# EAGLE design controller_board3 (EAGLE 9.4.0)
Assembly variants: Minimal, FullAwesome
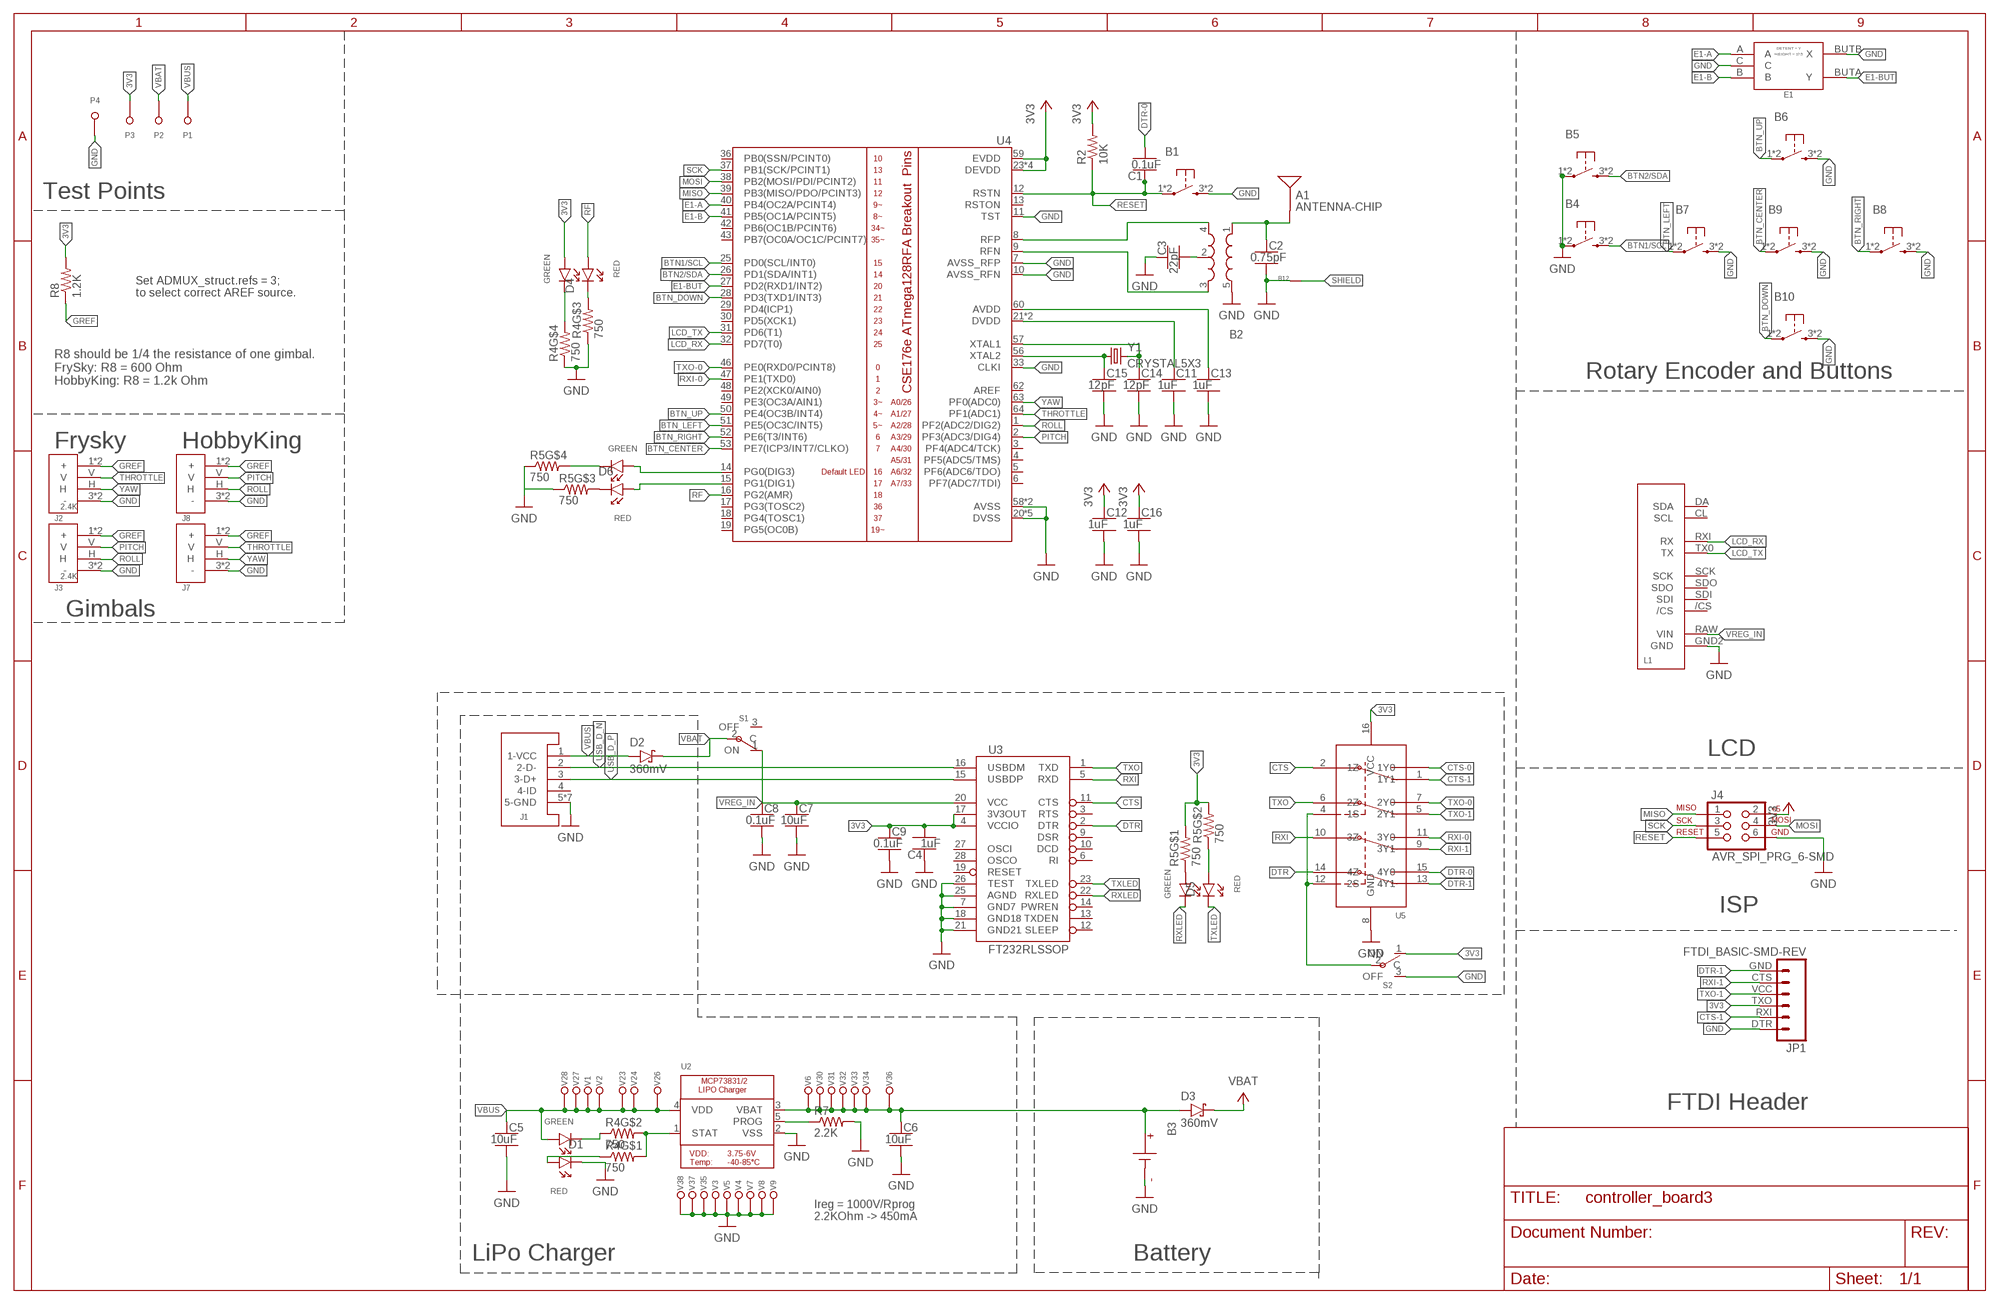
[diagram p0: schematic, sheet 1]
FRAME1 (FRAME_B_L): CREATOR: Unknown; DIST: Unknown; DISTPN: Unknown

## Parts
A1  ANTENNA-CHIP  [ANTENNA-CHIP]
B1  PUSHBUTTON_-4.5X4.5  [4.5MM_TACTILE_SWITCH_TL3305AF160QG]
B2  BALUN0805  [BALUN]
B3  BATTERY  [BATTERY-TERMINALS]
B4  PUSHBUTTON_-4.5X4.5  [4.5MM_TACTILE_SWITCH_TL3305AF160QG]  (not fitted in variant Minimal)
B5  PUSHBUTTON_-4.5X4.5  [4.5MM_TACTILE_SWITCH_TL3305AF160QG]  (not fitted in variant Minimal)
B6  PUSHBUTTON_-4.5X4.5  [4.5MM_TACTILE_SWITCH_TL3305AF160QG]
B7  PUSHBUTTON_-4.5X4.5  [4.5MM_TACTILE_SWITCH_TL3305AF160QG]
B8  PUSHBUTTON_-4.5X4.5  [4.5MM_TACTILE_SWITCH_TL3305AF160QG]
B9  PUSHBUTTON_-4.5X4.5  [4.5MM_TACTILE_SWITCH_TL3305AF160QG]
B10  PUSHBUTTON_-4.5X4.5  [4.5MM_TACTILE_SWITCH_TL3305AF160QG]
B12  NET_BRIDGE  [NET_BRIDGE]
C1  0.1uF  CAPACITOR-NP_SMD-2012-0805_CERAMIC-0.1UF  [CAPC2012X140_HS]
C2  0.75pF  CAPACITOR-NP_SMD-2012-0805_CERAMIC-0.75PF  [CAPC2012X140_HS]
C3  22pF  CAPACITOR-NP_SMD-2012-0805_CERAMIC-22PF  [CAPC2012X140_HS]
C4  1uF  CAPACITOR-NP_SMD-2012-0805_CERAMIC-1UF  [CAPC2012X140_HS]
C5  10uF  CAPACITOR-NP_SMD-0603_CERAMIC-10UF  [CAPC1608X100]
C6  10uF  CAPACITOR-NP_SMD-0603_CERAMIC-10UF  [CAPC1608X100]
C7  10uF  CAPACITOR-NP_SMD-0603_CERAMIC-10UF  [CAPC1608X100]  (not fitted in variant Minimal)
C8  0.1uF  CAPACITOR-NP_SMD-2012-0805_CERAMIC-0.1UF  [CAPC2012X140_HS]  (not fitted in variant Minimal)
C9  0.1uF  CAPACITOR-NP_SMD-2012-0805_CERAMIC-0.1UF  [CAPC2012X140_HS]  (not fitted in variant Minimal)
C11  1uF  CAPACITOR-NP_SMD-2012-0805_CERAMIC-1UF  [CAPC2012X140_HS]
C12  1uF  CAPACITOR-NP_SMD-2012-0805_CERAMIC-1UF  [CAPC2012X140_HS]
C13  1uF  CAPACITOR-NP_SMD-2012-0805_CERAMIC-1UF  [CAPC2012X140_HS]
C14  12pF  CAPACITOR-NP_SMD-2012-0805_CERAMIC-12PF  [CAPC2012X140_HS]
C15  12pF  CAPACITOR-NP_SMD-2012-0805_CERAMIC-12PF  [CAPC2012X140_HS]
C16  1uF  CAPACITOR-NP_SMD-2012-0805_CERAMIC-1UF  [CAPC2012X140_HS]
D1  LED-2X-GREEN/RED-1.6X1.5MM  [LED-2X-LITE-ON-1.6MMX1.5MM]
D2  360mV  DIODE-SCHOTTKY_SMD-SOD123-360MV  [SOD3716X135_HS]
D3  360mV  DIODE-SCHOTTKY_SMD-SOD123-360MV  [SOD3716X135_HS]
D4  LED-2X-GREEN/RED-1.6X1.5MM  [LED-2X-LITE-ON-1.6MMX1.5MM]
D5  LED-2X-GREEN/RED-1.6X1.5MM  [LED-2X-LITE-ON-1.6MMX1.5MM]  (not fitted in variant Minimal)
D6  LED-2X-GREEN/RED-1.6X1.5MM  [LED-2X-LITE-ON-1.6MMX1.5MM]
E1  ROTARY-ENCODER-W/BUTTON-BOURNS-PEC12R-4217F  [BOURNS-PEC12R]
J1  USB-MICROA-AMPHENOL-10118192-0001LF  [USB-MICROA-10118192-0001LF]  (not fitted in variant Minimal)
J2  2.4K  FRSKY-GIMBAL-FRYSKY  [JST-13-PTH]  (not fitted in variant Minimal)
J3  2.4K  FRSKY-GIMBAL-FRYSKY  [JST-13-PTH]  (not fitted in variant Minimal)
J4  AVR_SPI_PRG_6-SMD  [2X3-SMD]
J7  FRSKY-GIMBAL-2X-SERVO-SMD  [2X-SERVO-SMD]
J8  FRSKY-GIMBAL-2X-SERVO-SMD  [2X-SERVO-SMD]
JP1  FTDI_BASIC-SMD-REV  [FTDI-BASIC-SMD]
L1  SPARKFUN_SERLCD_SERIAL_REDUCED-SMD  [SPARKFUN_SERLCD_16X2_REDUCED_SMD]
P1  TEST-POINT  [TEST-POINT-KEYSTONE-5000]  (not fitted in variant Minimal)
P2  TEST-POINT  [TEST-POINT-KEYSTONE-5000]  (not fitted in variant Minimal)
P3  TEST-POINT  [TEST-POINT-KEYSTONE-5000]  (not fitted in variant Minimal)
P4  TEST-POINT  [TEST-POINT-KEYSTONE-5000]  (not fitted in variant Minimal)
R2  10K  RESISTOR_SMD-2012-0805-10K  [RESC2012X60_HS]
R4  750  RESISTOR-PACK-4X-750  [RESCAXS50P200X100X45-8]
R5  750  RESISTOR-PACK-4X-750  [RESCAXS50P200X100X45-8]
R7  2.2K  RESISTOR_SMD-2012-0805-2.2K  [RESC2012X60_HS]
R8  1.2K  RESISTOR_SMD-2012-0805-1.2K  [RESC2012X60_HS]  (not fitted in variant Minimal)
S1  POWER-SWITCH-MFS201N-9-Z-SMD-VERTICAL  [JS102011JCQN]  (not fitted in variant Minimal)
S2  POWER-SWITCH-MFS201N-9-Z-SMD-VERTICAL  [JS102011JCQN]  (not fitted in variant Minimal)
U2  MCP73831T-2ACI/OT  MCP73831/2  [SOT23-5]
U3  FT232RLSSOP  [SSOP28DB]  (not fitted in variant Minimal)
U4  ATMEGA128RFA1  [QFN-64]
U5  DPDT-X2  [SOP65P640X110-16]  (not fitted in variant Minimal)
V1  LOCKED-VIA-0.2  [VIA-0.2MM]
V2  LOCKED-VIA-0.2  [VIA-0.2MM]
V3  LOCKED-VIA-0.2  [VIA-0.2MM]
V4  LOCKED-VIA-0.2  [VIA-0.2MM]
V5  LOCKED-VIA-0.2  [VIA-0.2MM]
V6  LOCKED-VIA-0.2  [VIA-0.2MM]
V7  LOCKED-VIA-0.2  [VIA-0.2MM]
V8  LOCKED-VIA-0.2  [VIA-0.2MM]
V9  LOCKED-VIA-0.2  [VIA-0.2MM]
V23  LOCKED-VIA-0.2  [VIA-0.2MM]
V24  LOCKED-VIA-0.2  [VIA-0.2MM]
V26  LOCKED-VIA-0.2  [VIA-0.2MM]
V27  LOCKED-VIA-0.2  [VIA-0.2MM]
V28  LOCKED-VIA-0.2  [VIA-0.2MM]
V30  LOCKED-VIA-0.2  [VIA-0.2MM]
V31  LOCKED-VIA-0.2  [VIA-0.2MM]
V32  LOCKED-VIA-0.2  [VIA-0.2MM]
V33  LOCKED-VIA-0.2  [VIA-0.2MM]
V34  LOCKED-VIA-0.2  [VIA-0.2MM]
V35  LOCKED-VIA-0.2  [VIA-0.2MM]
V36  LOCKED-VIA-0.2  [VIA-0.2MM]
V37  LOCKED-VIA-0.2  [VIA-0.2MM]
V38  LOCKED-VIA-0.2  [VIA-0.2MM]
Y1  CRYSTAL5X3  [CRYSTAL-SMD-5X3]

## Nets
3V3 [HIGH-I]: C4.2 C9.1 C12.1 C16.1 D4.A2 J4.2 JP1.TXO P3.T R2.2 R5.5 R5.6 R8.2 S2.1(ON) U3.4(VCCIO) U3.17(3V3OUT) U4.23(DEVDD) U4.34(DEVDD) U4.44(DEVDD) U4.54(DEVDD) U4.59(EVDD) U5.16(VCC)
ANTENNA [RFSIG]: A1.FEED(SIGNAL) B2.1(IN) C2.1
BCAP: B2.2(GND) C3.2
BPOS [LONG_PWR]: B3.+(P) C6.1 D3.A U2.3(VBAT) V6.P1(N) V30.P1(N) V31.P1(N) V32.P1(N) V33.P1(N) V34.P1(N) V36.P1(N)
BTN1/SCL: B4.3 B4.4 U4.25(PD0(SCL/INT0))
BTN2/SDA: B5.3 B5.4 U4.26(PD1(SDA/INT1))
BTN_CENTER: B9.1 B9.2 U4.53(PE7(ICP3/INT7/CLKO))
BTN_DOWN: B10.1 B10.2 U4.28(PD3(TXD1/INT3))
BTN_LEFT: B7.1 B7.2 U4.51(PE5(OC3C/INT5))
BTN_RIGHT: B8.1 B8.2 U4.52(PE6(T3/INT6))
BTN_UP: B6.1 B6.2 U4.50(PE4(OC3B/INT4))
CLK_NEG: C15.1 U4.56(XTAL2) Y1.1
CLK_POS: C14.1 U4.57(XTAL1) Y1.3
CTS: U3.11(CTS) U5.2(1Z)
CTS-0: U5.3(1Y0)
CTS-1: JP1.RXI U5.1(1Y1)
DTR: U3.2(DTR) U5.14(4Z)
DTR-0: C1.2 U5.15(4Y0)
DTR-1: JP1.GND U5.13(4Y1)
E1-A: E1.A U4.40(PB4(OC2A/PCINT4))
E1-B: E1.B U4.41(PB5(OC1A/PCINT5))
E1-BUT: E1.BUTA(Y) U4.27(PD2(RXD1/INT2))
GND [HIGH-I]: B1.3 B1.4 B2.5(GND) B3.-(N) B4.1 B4.2 B5.1 B5.2 B6.3 B6.4 B7.3 B7.4 B8.3 B8.4 B9.3 B9.4 B10.3 B10.4 B12.P1 C2.2 C3.1 C4.1 C5.2 C6.2 C7.2 C8.2 C9.2 C11.2 C12.2 C13.2 C14.2 C15.2 C16.2 D1.C1 E1.BUTB(X) E1.C J1.5(5-GND) J1.6(5-GND) J1.7(5-GND) J1.8(5-GND) J1.9(5-GND) J1.10(5-GND) J1.11(5-GND) J2.3(-) J2.6(-) J3.3(-) J3.6(-) J4.6 J7.3(-) J7.6(-) J8.3(-) J8.6(-) JP1.DTR L1.GND2(GND) P4.T R4.1 R4.2 R5.1 R5.2 R7.2 S2.3(OFF) U2.2(VSS) U3.7(GND7) U3.18(GND18) U3.21(GND21) U3.25(AGND) U3.26(TEST) U4.7(AVSS_RFP) U4.10(AVSS_RFN) U4.11(TST) U4.20(DVSS) U4.24(DVSS) U4.33(CLKI) U4.35(DVSS) U4.45(DVSS) U4.55(DVSS) U4.58(AVSS) U4.61(AVSS) U5.8(GND) V3.P1(N) V4.P1(N) V5.P1(N) V7.P1(N) V8.P1(N) V9.P1(N) V35.P1(N) V37.P1(N) V38.P1(N)
GREF: J2.1(+) J2.4(+) J3.1(+) J3.4(+) J7.1(+) J7.4(+) J8.1(+) J8.4(+) R8.1
LCD_RX: L1.RXI(RX) U4.32(PD7(T0))
LCD_TX: L1.TX0(TX) U4.31(PD6(T1))
MISO: J4.1 U4.39(PB3(MISO/PDO/PCINT3))
MOSI: J4.4 U4.38(PB2(MOSI/PDI/PCINT2))
N$1: D1.A1 R4.4
N$2: D1.C2 R4.3
N$3: D5.A1 R5.3
N$4: D6.C2 R5.8
N$5: D6.C1 R5.7
N$6: D4.C1 R4.7
N$7: D5.A2 R5.4
N$8: D6.A2 U4.14(PG0(DIG3))
N$9: D6.A1 U4.15(PG1(DIG1))
N$11: R4.5 R4.6 U2.1(STAT)
N$12: R7.1 U2.5(PROG)
N$13: D4.C2 R4.8
N$20: C11.1 U4.21(DVDD) U4.22(DVDD)
N$21: C13.1 U4.60(AVDD)
PITCH: J3.V J8.V U4.2(PF3(ADC3/DIG4))
PROG_SEL: S2.2(C) U5.4(1S) U5.12(2S)
RESET: B1.1 B1.2 C1.1 J4.5 R2.1 U4.12(RSTN)
RF: D4.A1 U4.16(PG2(AMR))
RF_N: B2.3(OUT2) U4.9(RFN)
RF_P: B2.4(OUT1) U4.8(RFP)
ROLL: J3.H J8.H U4.1(PF2(ADC2/DIG2))
RXI: U3.5(RXD) U5.10(3Z)
RXI-0: U4.47(PE1(TXD0)) U5.11(3Y0)
RXI-1: JP1.CTS U5.9(3Y1)
RXLED: D5.C2 U3.22(RXLED)
SCK: J4.3 U4.37(PB1(SCK/PCINT1))
SHIELD: B12.P2
THROTTLE: J2.V J7.V U4.64(PF1(ADC1))
TXLED: D5.C1 U3.23(TXLED)
TXO: U3.1(TXD) U5.6(2Z)
TXO-0: U4.46(PE0(RXD0/PCINT8)) U5.7(2Y0)
TXO-1: JP1.VCC U5.5(2Y1)
USB_D_N: J1.2(2-D-) U3.16(USBDM)
USB_D_P: J1.3(3-D+) U3.15(USBDP)
VBAT [PWR]: D2.C D3.C P2.T S1.2(C)
VBUS [PWR]: C5.1 D1.A2 D2.A J1.1(1-VCC) P1.T U2.4(VDD) V1.P1(N) V2.P1(N) V23.P1(N) V24.P1(N) V26.P1(N) V27.P1(N) V28.P1(N)
VREG_IN [PWR]: C7.1 C8.1 L1.RAW(VIN) S1.1(ON) U3.20(VCC)
YAW: J2.H J7.H U4.63(PF0(ADC0))
Unconnected: J1.4(4-ID) L1./CS L1.CL(SCL) L1.DA(SDA) L1.SCK L1.SDI L1.SDO S1.3(OFF) U3.3(RTS) U3.6(RI) U3.9(DSR) U3.10(DCD) U3.12(SLEEP) U3.13(TXDEN) U3.14(PWREN) U3.19(RESET) U3.27(OSCI) U3.28(OSCO) U4.3(PF4(ADC4/TCK)) U4.4(PF5(ADC5/TMS)) U4.5(PF6(ADC6/TDO)) U4.6(PF7(ADC7/TDI)) U4.13(RSTON) U4.17(PG3(TOSC2)) U4.18(PG4(TOSC1)) U4.19(PG5(OC0B)) U4.29(PD4(ICP1)) U4.30(PD5(XCK1)) U4.36(PB0(SSN/PCINT0)) U4.42(PB6(OC1B/PCINT6)) U4.43(PB7(OC0A/OC1C/PCINT7)) U4.48(PE2(XCK0/AIN0)) U4.49(PE3(OC3A/AIN1)) U4.62(AREF)

## Notes on the sheet
- Test Points
- Set ADMUX_struct.refs = 3;
  to select correct AREF source.
- Rotary Encoder and Buttons
- R8 should be 1/4 the resistance of one gimbal.
  FrySky: R8 = 600 Ohm
  HobbyKing: R8 = 1.2k Ohm
- Frysky | HobbyKing
- Gimbals
- LCD
- ISP
- FTDI Header
- Ireg = 1000V/Rprog
  2.2KOhm -> 450mA
- LiPo Charger | Battery

## Library data of the parts
A1 = quadparts_prebuilt:ANTENNA: Single endded antenna.; CREATOR: Swanson; DATASHEET: http://www.linxtechnologies.com/resources/data-guides/ant-xxx-chp-x.pdf; DIST: Digikey; DISTPN: ANT-2.45-CHPCT-ND; MFR: Linx Technologies Inc.; MOUNTING: SMD; MPN: ANT-2.45-CHP-T; PRICE: 3.16; REVIEWER: Swanson
B1 B4-B10 = quadparts_prebuilt:PUSHBUTTON_: "Tactile" or "clicky" button.; CREATOR: Swanson; DIST: DIGIKEY; DISTPN: EG5350CT-ND; MOUNTING: SMD
B2 = quadparts_prebuilt:BALUN: A balun to convert differential radio-frequency outputs from the microcontroller into a single-ended driver for the antenna.; CREATOR: Swanson; DATASHEET: http://katalog.we-online.de/pbs/datasheet/748421245.pdf; DIST: Digikey; DISTPN: 732-2230-1-ND; MFR: Wurth Electronics Inc; MOUNTING: SMD; MPN: 748421245; PRICE: 2.63; REVIEWER: Swanson
B3 = quadparts_prebuilt:BATTERY: Connections for a battery.; CREATOR: Swanson; DIST: NA; DISTPN: NA; MOUNTING: NONE
B12 = custom:NET_BRIDGE; CREATOR: Michael Gonzalez; DIST: NA; DISTPN: NA
C1 C8 C9 = quadparts_prebuilt:CAPACITOR-NP_: Nonpolarized capacitor; CREATOR: Swanson; DIST: Digikey; DISTPN: 445-1418-1-ND; MFR: TDK; MOUNTING: SMD; MPN: C2012X7R2A104K125AA; REVIEWER: Swanson
C2 = quadparts_prebuilt:CAPACITOR-NP_: Nonpolarized capacitor; CREATOR: Swanson; DIST: Digikey; DISTPN: 490-3585-1-ND; MFR: Murata Electronics North America; MOUNTING: SMD; MPN: GQM2195C2AR75CB01D; REVIEWER: Swanson
C3 = quadparts_prebuilt:CAPACITOR-NP_: Nonpolarized capacitor; CREATOR: Swanson; DIST: Digikey; DISTPN: 490-5534-1-ND; MFR: Murata Electronics North America; MOUNTING: SMD; MPN: GRM21A5C2E220JW01D; REVIEWER: Swanson
C4 C11-C13 C16 = quadparts_prebuilt:CAPACITOR-NP_: Nonpolarized capacitor; CREATOR: Swanson; DIST: Digikey; DISTPN: 587-1281-1-ND; MFR: Taiyo Yuden; MOUNTING: SMD; MPN: TMK212B7105KG-T; REVIEWER: Swanson
C5-C7 = quadparts_prebuilt:CAPACITOR-NP_: Nonpolarized capacitor; CREATOR: Swanson; DIST: Digikey; DISTPN: 1276-1119-1-ND; MOUNTING: SMD
C14 C15 = quadparts_prebuilt:CAPACITOR-NP_: Nonpolarized capacitor; CREATOR: Swanson; DIST: Digikey; DISTPN: 490-5531-1-ND; MFR: Murata Electronics North America; MOUNTING: SMD; MPN: GRM21A5C2E120JW01D; REVIEWER: Swanson
D1 D4-D6 = RemoteParts:LED-2X; COLOR1: GREEN; COLOR2: RED; CREATOR: Swanson; DIST: DIGIKEY; DISTPN: 160-2252-1-ND; MOUNTING: SMD
D2 D3 = quadparts_prebuilt:DIODE-SCHOTTKY_: Schottky diode; CREATOR: Swanson; DIST: Digikey; DISTPN: CRS08QMCT-ND; MFR: Toshiba Semiconductor and Storage; MOUNTING: SMD; MPN: CRS08(TE85L,Q,M); REVIEWER: Swanson
E1 = RemoteParts:ROTARY-ENCODER-W/BUTTON; AUX1DIST: DIGIKEY; AUX1DISTPN: 1722-1241-ND; CREATOR: Swanson; DETENT: Y; DIST: DIGIKEY; DISTPN: PEC12R-4217F-S0024-ND; HEIGHT: 17.5; MOUNTING: TH
J1 = RemoteParts:USB; CREATOR: Swanson; DIST: DIGIKEY; DISTPN: 609-4613-1-ND; MOUNTING: SMD
J2 = RemoteParts:FRSKY-GIMBAL; CREATOR: Swanson; DIST: Digikey; DISTPN: A100106-ND; MOUNTING: TH
J3 = RemoteParts:FRSKY-GIMBAL; CREATOR: Swanson; DIST: Digikey; DISTPN: A100106-ND; MOUNTING: TH; SPICEPREFIX: E
J4 = quadparts_prebuilt:AVR_SPI_PRG_6: AVR ISP 6 Pin This is the in-system programming (ISP) connector for Atmel Microcontrollers programming.; CREATOR: Swanson; DIST: Digikey; DISTPN: 952-1922-ND; MOUNTING: SMD
J7 J8 = RemoteParts:FRSKY-GIMBAL
JP1 = quadparts_prebuilt:FTDI_BASIC: FTDI (USB-serial converter) header bins with labels.; DIST: DIGIKEY; DISTPN: 952-3235-ND; LEFT_PIN: G; MOUNTING: SMD; RIGHT_PIN: B
L1 = RemoteParts:SPARKFUN_SERLCD_SERIAL_REDUCED; AUX1DIST: DIGIKEY; AUX1DISTPN: 952-1842-ND; AUX2DIST: Digikey; AUX2DISTPN: S5641-ND; CREATOR: Swanson; DIST: Sparkfun; DISTPN: LCD-14072
P1-P4 = RemoteParts:TEST-POINT; CREATOR: Swanson; DIST: DIGIKEY; DISTPN: 36-5001-ND; MOUNTING: TH
R2 = quadparts_prebuilt:RESISTOR_: Resistor; CREATOR: Swanson; DIST: Digikey; DISTPN: 311-10KARCT-ND; MFR: Yageo; MOUNTING: SMD; MPN: RC0805JR-0710KL; REVIEWER: Swanson
R4 R5 = quadparts_prebuilt:RESISTOR-PACK-4X; CREATOR: Swanson; DIST: DIGIKEY; DISTPN: Y10751CT-ND; MOUNTING: SMD
R7 = quadparts_prebuilt:RESISTOR_: Resistor; CREATOR: SWANSON; DIST: DIGIKEY; DISTPN: YAG3776CT-ND; MOUNTING: SMD
R8 = quadparts_prebuilt:RESISTOR_: Resistor; CREATOR: Swanson; DIST: DIGIKEY; DISTPN: 311-1.20KCRCT-ND; MOUNTING: SMD
S1 S2 = RemoteParts:POWER-SWITCH-MFS201N-9-Z; CREATOR: Swanson; DIST: DIGIKEY; DISTPN: CKN10721CT-ND; MOUNTING: SMD
U2 = RemoteParts:MCP73831/2: MCP73831/2 LIPO Charger VDD: 3.75 - 6V Temp -40 - 85°C Programmable Charge Rate: 15-500mA NOTE: STAT is a tri-state logic output on the MCP73831 and an open-drain output on the MCP73832. SOT23-5 with 4.2V output and tri-state logic on STAT = MCP73831T-2ACI/OT; CREATOR: Adafruit; DIST: DIGIKEY; DISTPN: MCP73831T-2ACI/OTCT-ND; MOUNTING: SMD
U3 = RemoteParts:FT232RL: USB UART FT232RL 4th Generation USB UART (USB <-> Serial) Controller. Spark Fun Electronics SKU : COM-00650; CREATOR: Swanson; DIST: DIGIKEY; DISTPN: 768-1007-1-ND; MOUNTING: SMD
U4 = quadparts_prebuilt:ATMEGA128RFA1: ATmega128RFA1 8-bit AVR Microcontroller with Low Power 2.4GHz Transceiver for ZigBee and IEEE 802.15.4; CREATOR: Swanson; DATASHEET: http://www.atmel.com/Images/Atmel-8266-MCU_Wireless-ATmega128RFA1_Datasheet.pdf; DIST: Digikey; DISTPN: ATMEGA128RFA1-ZU-ND; MFR: Atmel; MOUNTING: SMD; MPN: ATMEGA128RFA1-ZUR00; PRICE: 10.21; REVIEWER: Swanson
U5 = RemoteParts:DPDT-X2; CREATOR: Swanson; DIST: DIGIKEY; DISTPN: 568-5300-1-ND; MOUNTING: SMD
V1-V9 V23 V24 V26-V28 V30-V38 = quadparts_prebuilt:LOCKED-VIA: A via that be removed via ripup.; CREATOR: Swanson; DIST: NA; DISTPN: NA; MOUNTING: NONE
Y1 = quadparts_prebuilt:CRYSTAL: Crystals to provide clock references for microcontrollers, etc.; CREATOR: Swanson; DATASHEET: http://www.abracon.com/Resonators/abm3b.pdf; DIST: Digikey; DISTPN: 535-9122-1-ND; MFR: Abracon LLC; MOUNTING: SMD; MPN: ABM3B-16.000MHZ-B2-T; PRICE: 0.68; PROD_ID: XTAL-08218; REVIEWER: Swanson

## Net classes
1 HIGH-I: drill 0.254 mm
2 RFSIG: width 1.016 mm
3 PWR: width 0.254 mm, drill 0.381 mm
4 LONG_PWR: width 0.254 mm, drill 0.381 mm

## Board
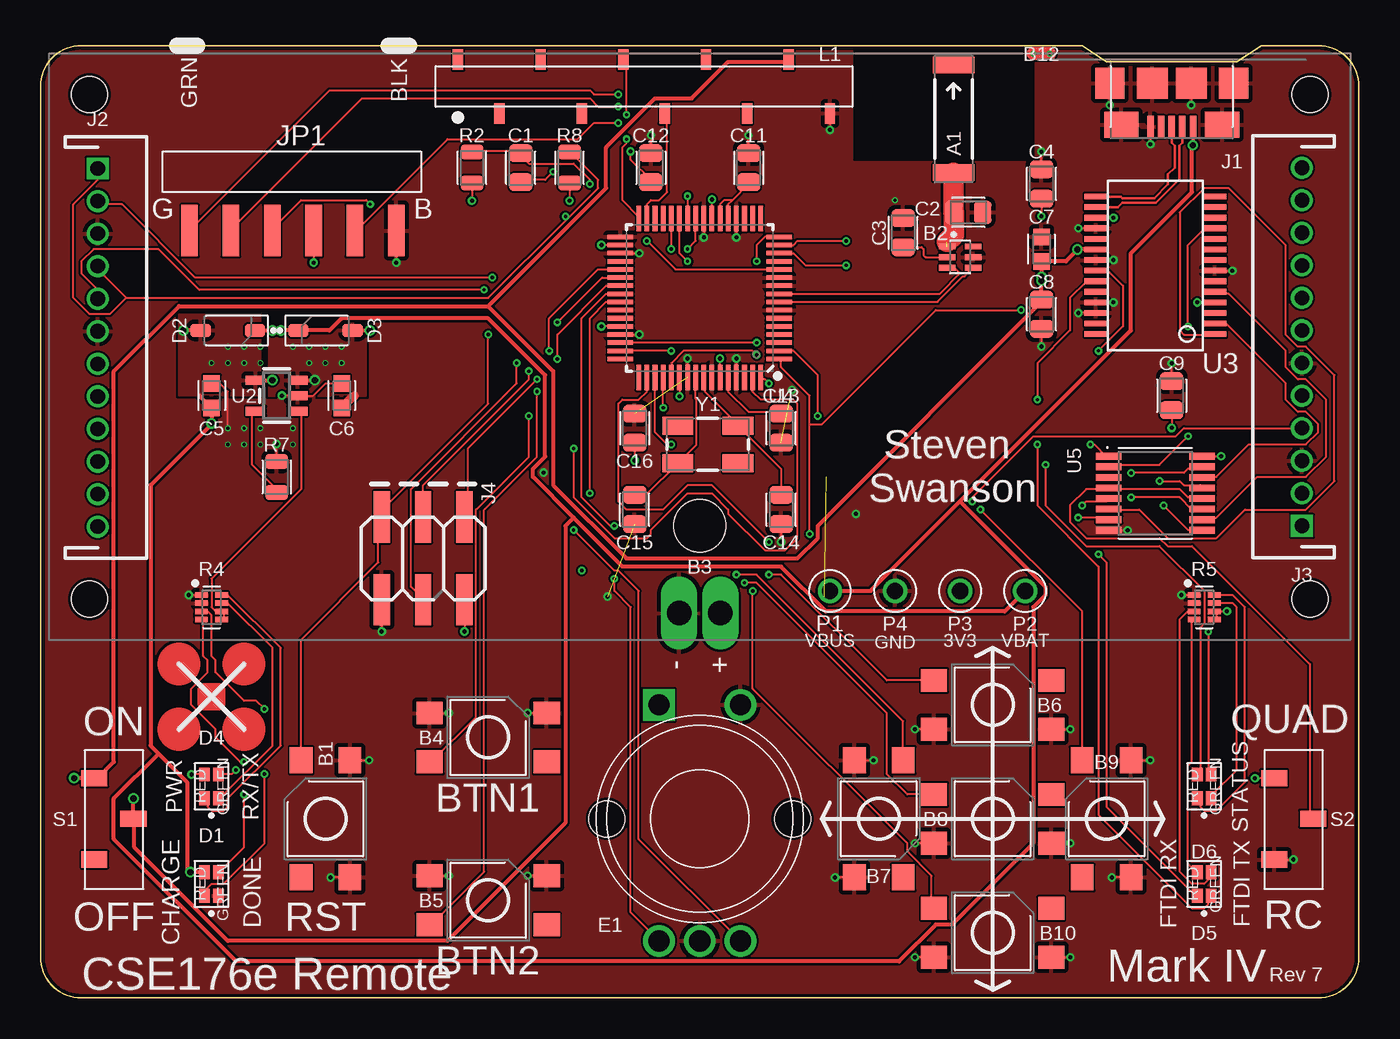
[diagram p1: board, top side]
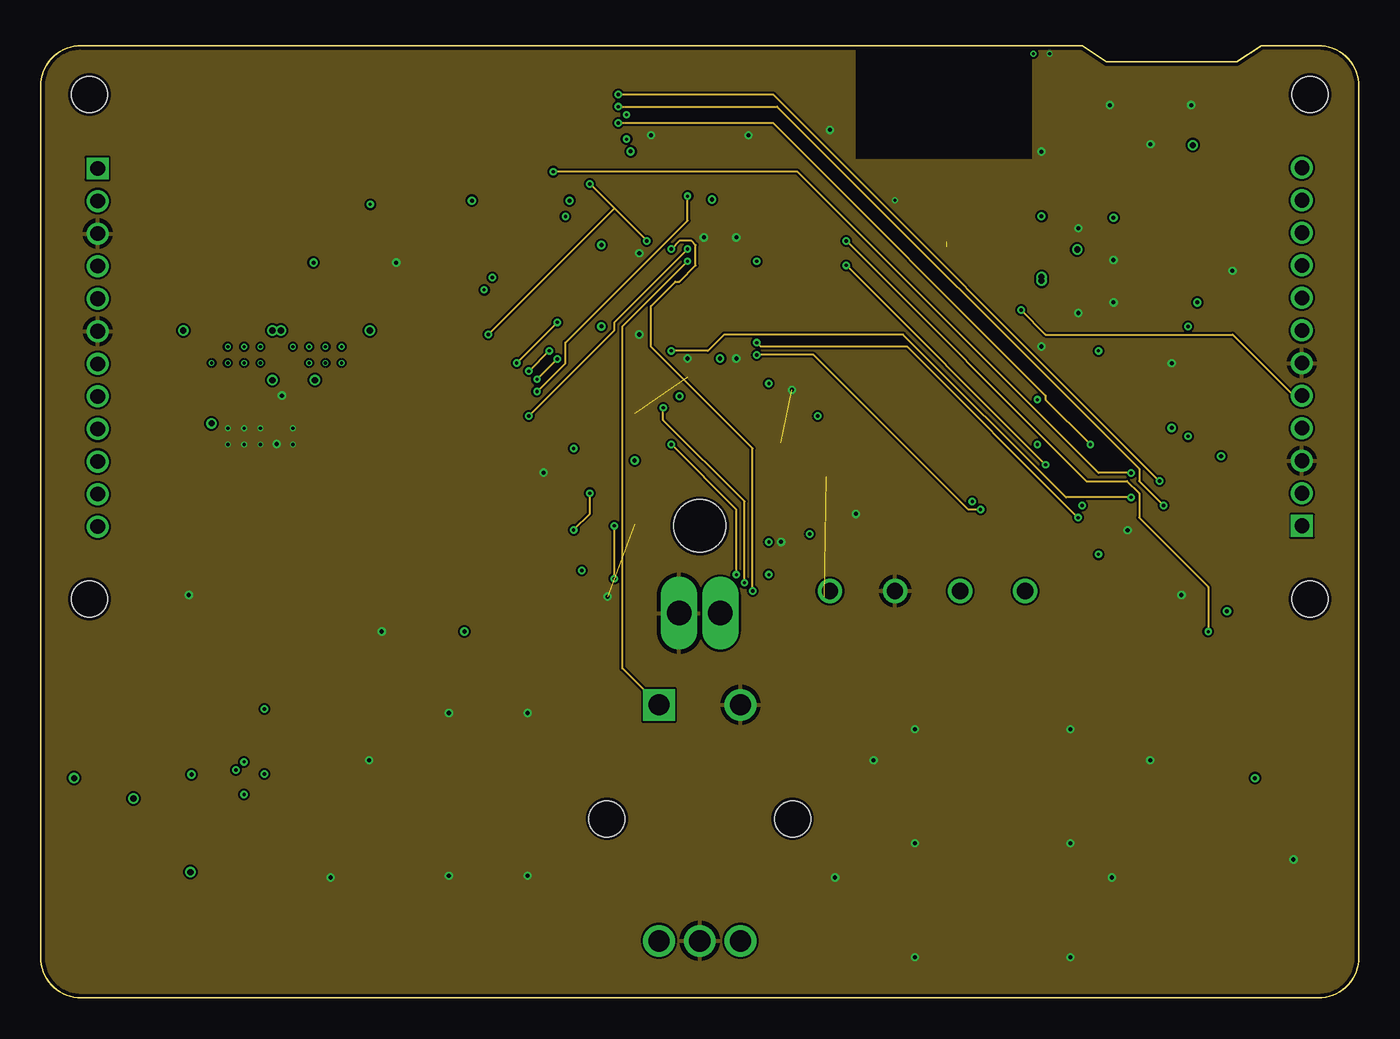
[diagram p2: board, inner layer Route2]
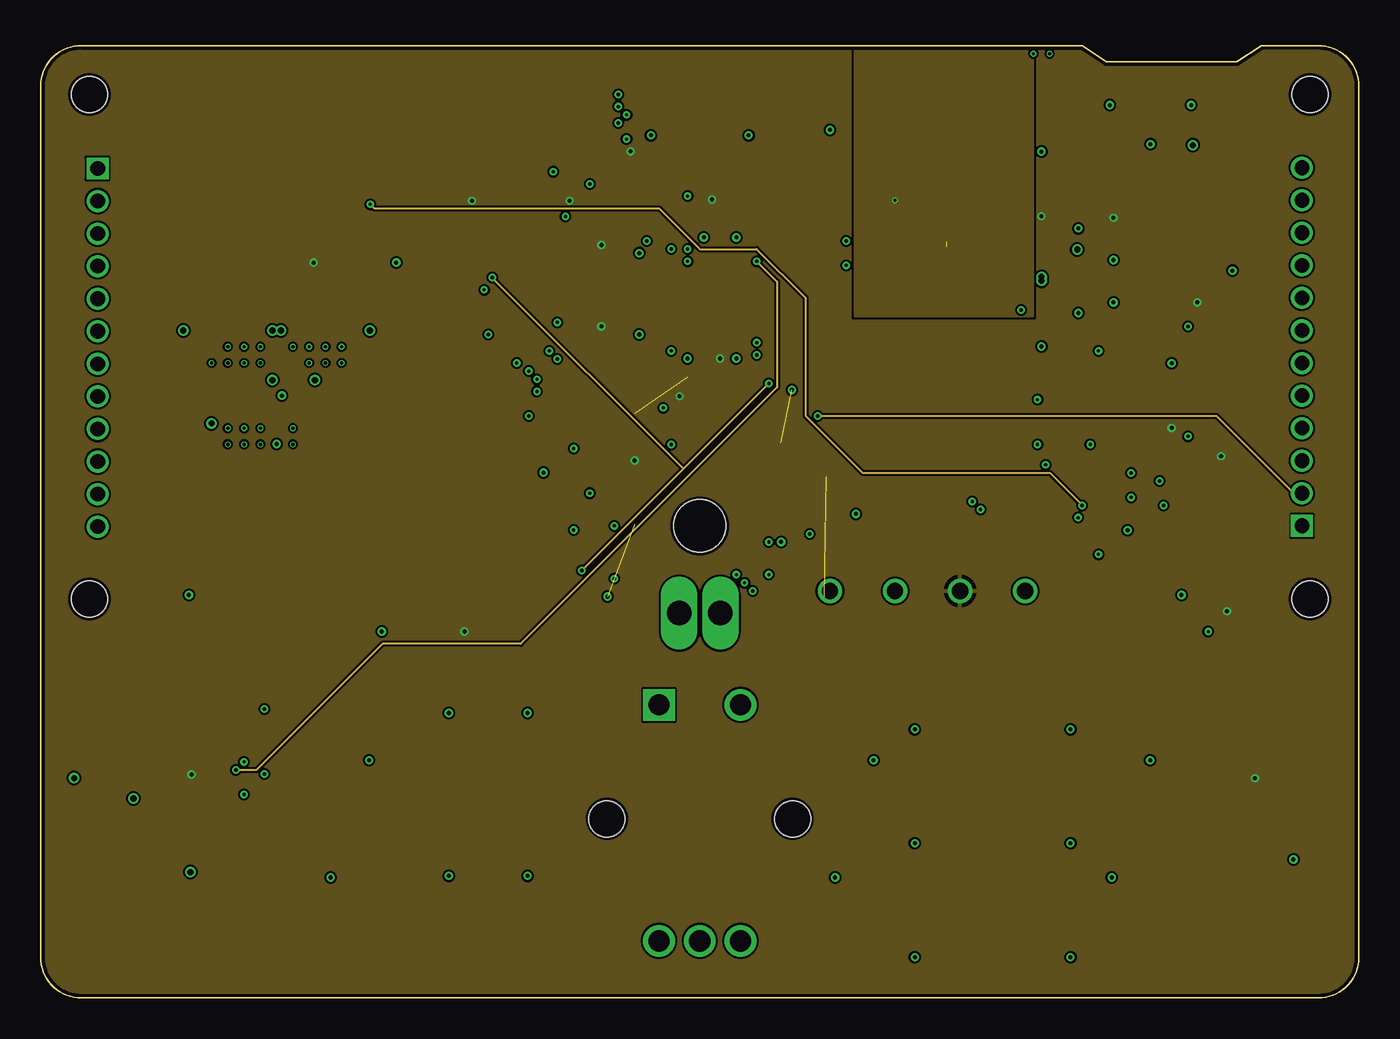
[diagram p3: board, inner layer Route15]
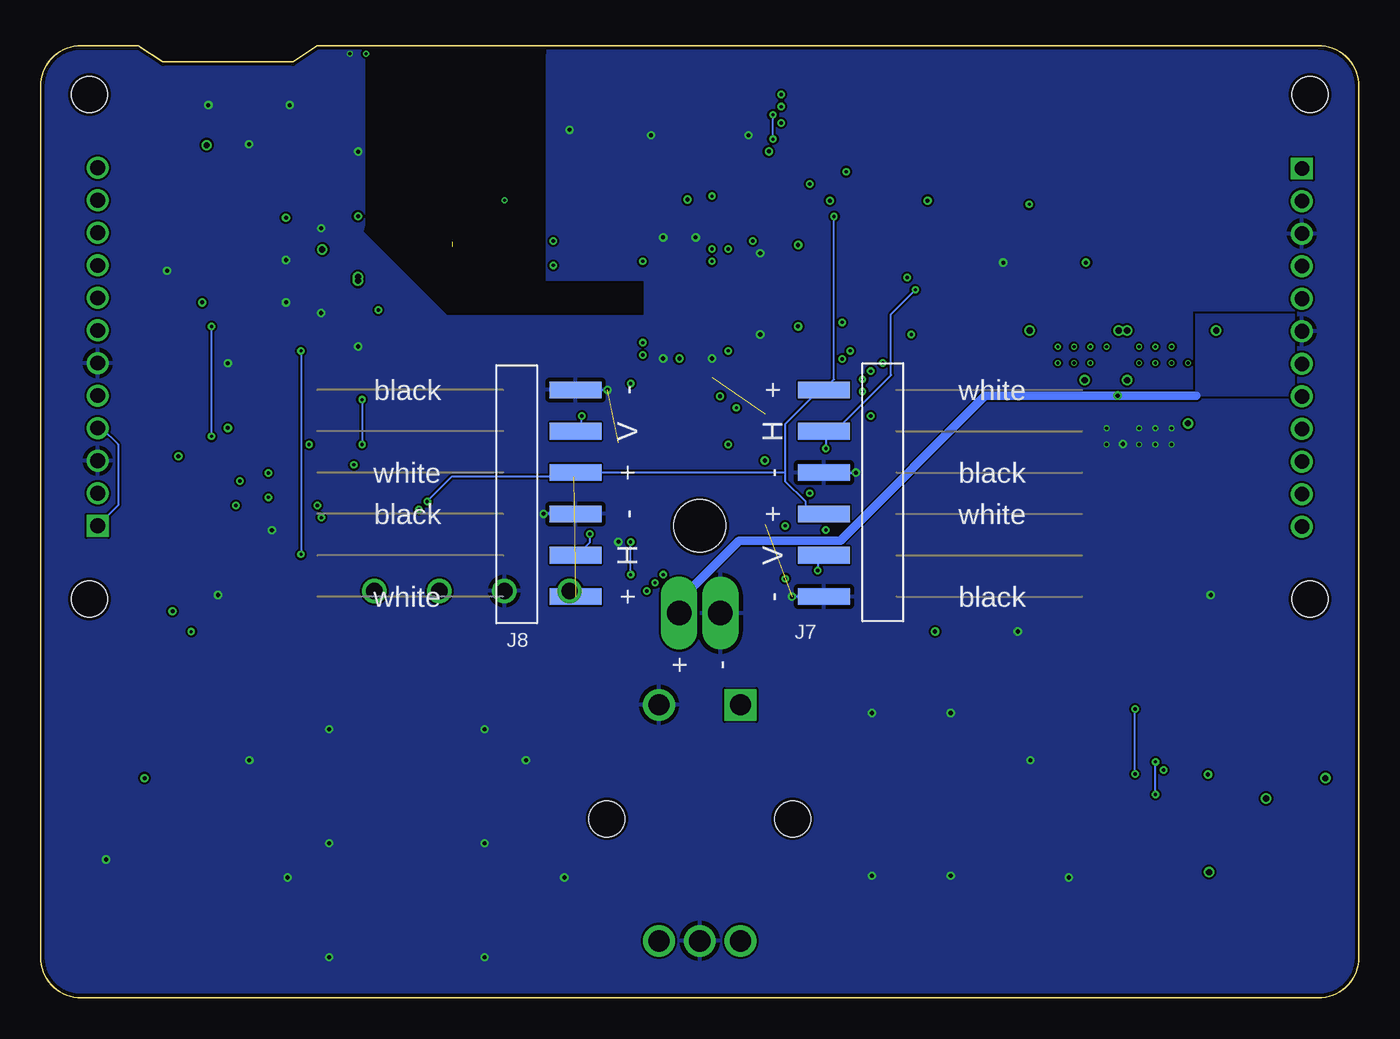
[diagram p4: board, bottom side, seen from below]

Size 81 x 58.5 mm. Coordinates in mm from the lower left corner, seen from the top.
Outline: 2.5,0 78.5,0 arc90 81,2.5 81,56 arc90 78.5,58.5 75,58.5 73.5,57.5 65.5,57.5 64,58.5 2.5,58.5 arc90 0,56 0,2.5 arc90 2.5,0
Copper layers (1*2*15*16): Top 0.035559375mm / dielectric 1.501140625mm / Route2 0.035559375mm / dielectric 0.149859375mm / Route15 0.035559375mm / dielectric 0.200659375mm / Bottom 0.035559375mm
Design rules "jlcpcb-4layer-5mil-small-cream": minimum track width 5mil, minimum drill 0.2mm, track to track 5mil, track to pad 5mil, pad to pad 5mil, via to via 5mil, smd to smd 5mil, copper to edge 0.2mm, drill to drill 10mil, minimum pad ring 3mil, minimum via ring 5mil, stop-mask expansion 3mil, vias tented up to drill 0.45mm, thermal gap 10mil
Holes 3.2 mm at 40.5,29
tRestrict: 4 lines
bRestrict: area 44,42 to 61.1,59; 4 lines

### Footprints (pad centres in the part's own frame; a part is rotated, then mirrored left to right if it is on the bottom)
ANTENNA-CHIP = smd 1.016 x 2.54: FEED -3.302,0; NC 3.302,0
4.5MM_TACTILE_SWITCH_TL3305AF160QG = smd 1.6 x 1.4: 1 -3.6,-1.5; 2 3.6,-1.5; 3 -3.6,1.5; 4 3.6,1.5
BALUN = smd 0.35 x 1: 1 -0.65,-0.8; 2 0,-0.8; 3 0.65,-0.8; 4 0.65,0.8; 5 0,0.8; 6 -0.65,0.8
BATTERY-TERMINALS = drill 1.5 long: + -1.27,-0.635; - 1.27,-0.635
NET_BRIDGE = drill 0.2: P1 -0.5,0; P2 0.5,0
CAPC2012X140_HS = smd 1.08 x 1.42: 1 -0.895,0; 2 0.895,0
CAPC1608X100 = smd 1.009 x 1.015: 1 -0.753,0; 2 0.753,0
LED-2X-LITE-ON-1.6MMX1.5MM = smd 0.85 x 0.65: A1 -0.725,0.425; A2 -0.725,-0.425; C1 0.725,0.425; C2 0.725,-0.425
SOD3716X135_HS = smd 1.25 x 0.8: A 1.665,0; C -1.665,0
BOURNS-PEC12R = drill 1.3: A -2.5,-7.5; B 2.5,-7.5; BUTB 2.5,7; C 0,-7.5 | drill 1.3 square: BUTA -2.5,7 | hole 2.2: -5.7,0; 5.7,0
FRSKY-TARANIS-GIMBAL = hole 2.2: -27,-27; -27,27; -27,27; 27,-27; 27,27
USB-MICROA-10118192-0001LF = smd 0.4 x 1.35: 1 -1.3,0; 2 -0.65,0; 3 0,0; 4 0.65,0; 5 1.3,0 | smd 2.1 x 1.6: 6 3.1,-0.125; 7 -3.1,-0.125 | smd 1.8 x 1.9: 8 -3.8,-2.675; 11 3.8,-2.675 | smd 1.9 x 1.9: 9 1.2,-2.675; 10 -1.2,-2.675
JST-13-PTH = drill 0.9 square: 1 -2,0 | drill 0.9: 3 2,0; 4 4,0; 6 8,0; 7 10,0; 8 12,0; 9 14,0; 10 16,0; 11 18,0; 12 20,0; H 6,0; V 0,0
2X3-SMD = smd 1 x 3.15: 1 -2.54,-2.54; 2 -2.54,2.54; 3 0,-2.54; 4 0,2.54; 5 2.54,-2.54; 6 2.54,2.54
2X-SERVO-SMD = smd 1.02 x 3.17: 1 -6.35,0.635; 3 -1.27,0.635; 4 1.27,0.635; 6 6.35,0.635; H -3.81,0.635; V 3.81,0.635
FTDI-BASIC-SMD = smd 1.02 x 3.17: CTS -3.81,0.635; DTR 6.35,0.635; GND -6.35,0.635; RXI 3.81,0.635; TXO 1.27,0.635; VCC -1.27,0.635
SPARKFUN_SERLCD_16X2_REDUCED_SMD = smd 0.635 x 1.27: /CS -7.24,14.336; CL 0.38,17.636; DA 2.92,14.336; GND2 8,14.336; RAW 5.46,17.636; RXI -4.7,17.636; SCK -14.86,17.636; SDI -9.78,17.636; SDO -12.32,14.336; TX0 -2.16,14.336 | hole 2.2: -37.5,-15.5; -37.5,15.5; 37.5,-15.5; 37.5,15.5
TEST-POINT-KEYSTONE-5000 = drill 1: T 0,0
RESC2012X60_HS = smd 0.92 x 1.38: 1 -0.955,0; 2 0.955,0
RESCAXS50P200X100X45-8 = smd 0.79 x 0.339: 1 -0.62,0.75; 2 -0.62,0.25; 3 -0.62,-0.25; 4 -0.62,-0.75; 5 0.62,-0.75; 6 0.62,-0.25; 7 0.62,0.25; 8 0.62,0.75
JS102011JCQN = smd 1 x 1.6: 1 -2.5,-1.2; 2 0,1.2; 3 2.5,-1.2
SOT23-5 = smd 0.55 x 1.2: 1 -0.95,-1.3; 2 0,-1.3; 3 0.95,-1.3; 4 0.95,1.3; 5 -0.95,1.3
SSOP28DB = smd 0.348 x 1.397: 1 -4.225,-3.656; 2 -3.575,-3.656; 3 -2.925,-3.656; 4 -2.275,-3.656; 5 -1.625,-3.656; 6 -0.975,-3.656; 7 -0.325,-3.656; 8 0.325,-3.656; 9 0.975,-3.656; 10 1.625,-3.656; 11 2.275,-3.656; 12 2.925,-3.656; 13 3.575,-3.656; 14 4.225,-3.656; 15 4.225,3.656; 16 3.575,3.656; 17 2.925,3.656; 18 2.275,3.656; 19 1.625,3.656; 20 0.975,3.656; 21 0.325,3.656; 22 -0.325,3.656; 23 -0.975,3.656; 24 -1.625,3.656; 25 -2.275,3.656; 26 -2.925,3.656; 27 -3.575,3.656; 28 -4.225,3.656
QFN-64 = smd 1.562 x 0.28: 1 -4.881,3.75; 2 -4.881,3.25; 3 -4.881,2.75; 4 -4.881,2.25; 5 -4.881,1.75; 6 -4.881,1.25; 7 -4.881,0.75; 8 -4.881,0.25; 9 -4.881,-0.25; 10 -4.881,-0.75; 11 -4.881,-1.25; 12 -4.881,-1.75; 13 -4.881,-2.25; 14 -4.881,-2.75; 15 -4.881,-3.25; 16 -4.881,-3.75; 33 4.881,-3.75; 34 4.881,-3.25; 35 4.881,-2.75; 36 4.881,-2.25; 37 4.881,-1.75; 38 4.881,-1.25; 39 4.881,-0.75; 40 4.881,-0.25; 41 4.881,0.25; 42 4.881,0.75; 43 4.881,1.25; 44 4.881,1.75; 45 4.881,2.25; 46 4.881,2.75; 47 4.881,3.25; 48 4.881,3.75 | smd 0.28 x 1.562: 17 -3.75,-4.881; 18 -3.25,-4.881; 19 -2.75,-4.881; 20 -2.25,-4.881; 21 -1.75,-4.881; 22 -1.25,-4.881; 23 -0.75,-4.881; 24 -0.25,-4.881; 25 0.25,-4.881; 26 0.75,-4.881; 27 1.25,-4.881; 28 1.75,-4.881; 29 2.25,-4.881; 30 2.75,-4.881; 31 3.25,-4.881; 32 3.75,-4.881; 49 3.75,4.881; 50 3.25,4.881; 51 2.75,4.881; 52 2.25,4.881; 53 1.75,4.881; 54 1.25,4.881; 55 0.75,4.881; 56 0.25,4.881; 57 -0.25,4.881; 58 -0.75,4.881; 59 -1.25,4.881; 60 -1.75,4.881; 61 -2.25,4.881; 62 -2.75,4.881; 63 -3.25,4.881; 64 -3.75,4.881
SOP65P640X110-16 = smd 1.572 x 0.407: 1 -2.872,2.275; 2 -2.872,1.625; 3 -2.872,0.975; 4 -2.872,0.325; 5 -2.872,-0.325; 6 -2.872,-0.975; 7 -2.872,-1.625; 8 -2.872,-2.275; 9 2.872,-2.275; 10 2.872,-1.625; 11 2.872,-0.975; 12 2.872,-0.325; 13 2.872,0.325; 14 2.872,0.975; 15 2.872,1.625; 16 2.872,2.275
VIA-0.2MM = drill 0.2 pad 0.3: P1 0,0
CRYSTAL-SMD-5X3 = smd 1.9 x 1.1: 1 -1.85,-1.15; 2 1.85,-1.15; 3 1.85,1.15; 4 -1.85,1.15

### Placement (x,y rotation side)
A1  56.1,54 90 top
B1  17.5,11 270 top
B2  56.5,45.5 270 top
B3  40.5,23 180 top
B4  27.5,16 180 top
B5  27.5,6 180 top
B6  58.5,18 180 top
B7  51.5,11 90 top
B8  58.5,11 180 top
B9  65.5,11 270 top
B10  58.5,4 180 top
B12  61.5,58 180 top
C1  29.5,51 270 top
C2  57,48.25 0 top
C3  53,47 270 top
C4  61.5,50 270 top
C5  10.5,37 90 top
C6  18.5,37 90 top
C7  61.5,46 90 top
C8  61.5,42 270 top
C9  69.5,37 90 top
C11  43.5,51 90 top
C12  37.5,51 90 top
C13  45.5,35 270 top
C14  45.5,30 270 top
C15  36.5,30 270 top
C16  36.5,35 90 top
D1  10.5,7 270 top
D2  11.5,41 180 top
D3  17.5,41 0 top
D4  10.5,13 270 top
D5  71.5,7 270 top
D6  71.5,13 270 top
E1  40.5,11 0 top
E$1  [FRSKY-TARANIS-GIMBAL]  -39.5,30 0 top  (outside the outline)
E$2  [FRSKY-TARANIS-GIMBAL]  120.5,30 180 top  (outside the outline)
J1  69.5,53.5 180 top
J2  3.5,48.95 270 top
J3  77.5,31 90 top
J4  23.5,27 180 top
J7  33.5,31 270 bottom
J8  47.5,31 90 bottom
JP1  15.5,46.5 0 top
L1  40.5,40 0 top
P1  48.5,25 90 top
P2  60.5,25 90 top
P3  56.5,25 90 top
P4  52.5,25 90 top
R2  26.5,51 270 top
R4  10.5,24 0 top
R5  71.5,24 0 top
R7  14.5,32 90 top
R8  32.5,51 270 top
S1  4.5,11 270 top
S2  77,11 270 top
U2  14.5,37 90 top
U3  68.5,45 90 top
U4  40.5,43 180 top
U5  68.5,31 0 top
U$1  [700MAH-BATTERY]  83.5,95 90 top  (outside the outline)
U$2  [QUADCLASS_LOGO_SMALL]  10.5,18.5 0 top
U$3  [LAYER_LABELS]  39.5,-12 0 top  (outside the outline)
U$4  [375MAH-BATTERY]  -31.5,32 0 top  (outside the outline)
U$5  [600MAH-BATTERY]  41.5,82 90 top  (outside the outline)
V1  11.5,39 180 top
V2  11.5,40 180 top
V3  12.5,34 0 top
V4  15.5,35 180 top
V5  15.5,34 0 top
V6  17.5,39 180 top
V7  13.5,34 180 top
V8  12.5,35 180 top
V9  52.5,49 0 top
V23  13.5,39 180 top
V24  13.5,40 180 top
V26  12.5,39 180 top
V27  12.5,40 180 top
V28  10.5,39 180 top
V30  17.5,40 180 top
V31  18.5,39 180 top
V32  18.5,40 180 top
V33  15.5,40 180 top
V34  16.5,40 180 top
V35  11.5,35 180 top
V36  16.5,39 180 top
V37  13.5,35 180 top
V38  11.5,34 180 top
Y1  41,34 0 top

### Tracks (layer width: path | path; a pad name or v marks a point on that pad's centre or on a via)
3V3  (via drill 0.25)
  Top 0.127: U3.17 v65.92,47.92 | U3.4 v71.08,42.73 | S2.1 v74.62,13.5 | C16.1 v36.5,33.01 | R2.2 v26.5,48.97 | J4.2 v26.04,22.5 | JP1.TXO v16.77,45.17 | C4.2 v61.5,48.01 | C9.1 v69.5,35.01 | D4.A2 v9.27,13.73 | 72.25,23.75 v72.9,23.75 | R8.2 v32.5,48.97 | U5.16 v72.54,33.27 | U4.44 v34.46,41.25 | U4.34 v34.46,46.25 | U4.54 v39.25,36.96 | U4.59 v41.75,39.28 | U4.23 v41.25,49.04 | 72.25,23.75 72.25,23.25 R5.5 | 72.25,23.75 R5.6 | v36.25,52 36.25,51.5 37.5,50.25 C12.1
  pour Route15 (rank 2): -5.5,72.49 50,72.49 50,59 61,59 61,72.5 86.5,72.5 86.5,-1.5 -5.5,-1.5
ANTENNA  (1 unrouted)
  Top 1.27: A1.FEED C2.1 56.11,46.84 55.7,46.44
BCAP
  Top 0.127: B2.2 54.38,45.5 54.25,45.62 54.25,46 54.12,46.12 53,46.12 C3.2
BPOS  (via drill 0.38)
  Top 0.254: D3.A v20.23,41 | U2.3 v16.84,37.95
  Top 0.508: C6.1 18.53,36.29 19.1,36.86 19.16,36.86 19.29,36.98 19.29,37
  Bottom 0.508: B3.+ 41.77,24.41 38.09,28.09 31.86,28.09 22.97,36.98 10.05,36.98 10,37
  pour Top: 14,37 20,37 20,42 14,42
  pour Bottom (rank 2): 4,37 10,37 10,42 4,42
BTN1/SCL  (via drill 0.2)
  Top 0.127: U4.25 40.25,46.5 v39.75,46 | v30,35.75 30,33.25 26.75,30 26.75,17.25 24,14.5 B4.4
  Route2 0.127: v39.75,46 35.25,41.5 35.25,41 v30,35.75
BTN2/SDA  (via drill 0.2)
  Top 0.127: v39.75,49.25 U4.26 | v30.5,37.25 30.5,33.25 27.25,30 27.25,7.75 24,4.5 B5.4
  Route2 0.127: v39.75,49.25 39.75,47.75 32.25,40.25 32.25,39 v30.5,37.25
BTN_CENTER  (via drill 0.2)
  Top 0.127: U4.53 38.75,39 39.5,39.75 43.75,39.75 v44,39.5 | v57.75,30 64,23.75 B9.1
  Route2 0.127: v44,39.5 47.5,39.5 57,30 v57.75,30
BTN_DOWN  (via drill 0.2)
  Top 0.127: v38.75,46 U4.28 | v43.75,25 43.75,19 53.25,9.5 53.25,9 54.75,7.5 54.75,5.5 B10.2
  Route2 0.127: v38.75,46 39.25,46.5 40,46.5 40.25,46.25 40.25,45 39.25,44 39,44 37.5,42.5 37.5,40 43.75,33.75 v43.75,25
BTN_LEFT  (via drill 0.2)
  Top 0.127: U4.51 37.75,34.75 38.5,34 v38.75,34 | v42.75,26 44,26 53,17 B7.2
  Route2 0.127: v38.75,34 42.75,30 v42.75,26
BTN_RIGHT  (via drill 0.2)
  Top 0.127: v38.25,36.25 U4.52 | v43.25,25.5 44,25.5 52,17.5 52,13.75 53.25,12.5 B8.2
  Route2 0.127: v38.25,36.25 38.25,35.5 43.25,30.5 v43.25,25.5
BTN_UP  (via drill 0.2)
  Top 0.127: U4.50 37.25,37.25 36.75,36.75 35.75,36.75 35.5,36.5 35.5,30.5 36,30 38.25,30 39.75,31.5 41.25,31.5 v44.75,28 | v44.75,26 45.5,26 52,19.5 B6.2
  Bottom 0.127: v44.75,26 v44.75,28
CLK_NEG
  Top 0.127: C15.1 37.2,30.89 Y1.1 40.29,33.99 40.29,36.78 40.25,36.82 U4.56
CLK_POS
  Top 0.127: U4.57 40.84,38.03 40.84,37.23 42.85,35.22 Y1.3 45.5,32.5 C14.1
CTS  (via drill 0.2)
  Top 0.127: v70.5,41.25 70.5,46.25 71.5,47.25 72,47.25 U3.11 | v70.5,34.5 68.75,32.75 65.75,32.75 U5.2
  Bottom 0.127: v70.5,34.5 v70.5,41.25
CTS-1  (via drill 0.2)
  Top 0.127: v64.5,34 64.75,34 65.5,33.25 U5.1 | v35.5,53.75 34,53.75 33,52.75 25,52.75 19.5,47.25 JP1.RXI
  Route2 0.127: v64.5,34 61.75,36.75 61.75,37 45,53.75 v35.5,53.75
DTR
  Top 0.127: U3.2 72.25,41.5 72.75,41.5 76.5,37.75 76.5,36.75 77.25,36 77.75,36 78.5,35.25 78.5,34.75 77.75,34 74.25,34 72.25,32 71.5,32 U5.14
DTR-0  (via drill 0.2)
  Top 0.127: v31.5,50.75 31,50.25 29.5,50.25 C1.2 | v67,32.25 70.25,32.25 70.5,32.5 71.25,32.5 U5.15
  Route2 0.127: v31.5,50.75 46.5,50.75 65,32.25 v67,32.25
DTR-1  (via drill 0.2)
  Top 0.127: v68.75,31.75 70,31.75 70.25,31.5 71.25,31.5 U5.13 | v35.5,55.5 34,55.5 33.75,55.75 17.75,55.75 9.25,47.25 JP1.GND
  Route2 0.127: v68.75,31.75 45,55.5 v35.5,55.5
E1-A  (via drill 0.2)
  Top 0.127: U4.40 34.75,43.25 33.25,41.75 33.25,30.75 35,29 v35.25,29 | v35.25,25.75 35.25,25 36.25,24 36.25,5.25 E1.A
  Route2 0.127: v35.25,25.75 v35.25,29
E1-B  (via drill 0.2)
  Top 0.127: U4.41 34.75,42.75 33.75,41.75 v33.75,31 | v32.75,28.75 35.25,26.25 35.5,26.25 36.75,25 36.75,9.75 E1.B
  Route2 0.127: v33.75,31 33.75,29.75 v32.75,28.75
E1-BUT  (via drill 0.2)
  Top 0.127: U4.27 39.25,45.75 v39.75,45.25
  Route2 0.127: v39.75,45.25 35.75,41.25 35.75,20.25 E1.BUTA
GND  (via drill 0.25)  (3 unrouted)
  Top 0.127: U4.45 v36.78,40.75 | U4.35 v36.78,45.75 | U4.61 v42.75,39.28 | U4.55 v39.75,39.28 | U4.20 v42.75,46.72 | U4.24 v40.75,46.72 | R5.1 v70.1,24.75 | C9.2 v69.5,38.99 | C4.1 v61.5,51.99 | C12.2 v37.5,52.99 | JP1.DTR v21.85,45.17 | B6.4 v53.72,16.5 | B6.3 v63.28,16.5 | J4.6 v20.96,22.5 | U3.26 v63.77,42.08 | U3.18 v63.77,47.27 | U3.25 v65.92,42.73 | U3.21 v65.92,45.33 | U3.7 v73.24,44.67 | B7.3 v48.82,7.4 | B7.4 v51.18,14.6 | C8.2 v61.5,40.01 | v14.82,37 U2.2 16.75,37 17.5,37.75 C6.2 | B8.4 v53.72,9.5 | B8.3 v63.28,9.5 | L1.GND2 v48.5,53.32 | B1.3 v20.18,14.6 | B1.4 v17.82,7.4 | C11.2 v43.5,52.99 | C14.2 v45.5,28.01 | R4.1 v9.1,24.75 | U5.8 v66.8,28.73 | B10.4 v53.72,2.5 | B10.3 v63.28,2.5 | S2.3 v76.98,8.5 | B4.2 v25.08,17.5 | B4.1 v29.92,17.5 | B9.3 v68.18,14.6 | B9.4 v65.82,7.4 | J1.5 v68.2,52.44 | J1.10 v70.7,54.84 | J1.11 v65.7,54.84 | R7.2 v14.5,34.03 | B5.2 v25.08,7.5 | B5.1 v29.92,7.5 | V35.P1 11.5,37.25 11,37.75 C5.2
  Bottom 0.127: J8.3 v50.1,29.73 | J8.6 v46.17,37.35 | J7.3 v30.9,32.27 | J7.6 v34.83,24.65
  pour Bottom: 10,36.5 8.5,36.5 8.5,33 10,33
  pour Top (rank 2): 50,64 -5,64 -5,-3 86,-3 86,64 61,64 61,51.5 50,51.5
  pour Route15: 61,59 61,41.84 50,41.84 50,59
  pour Route2: -6,65 50,65 50,51.5 61,51.5 61,65 87,65 87,-1 -6,-1
  pour Bottom (rank 4): 50,65.5 -6.5,65.5 -6.5,-1.5 87.5,-1.5 87.5,65.5 61,65.5 61,51.5 50,51.5
GREF  (via drill 0.2)  (1 unrouted)
  Top 0.127: 32.25,47.75 27.5,43 5.25,43 | 32.25,47.75 34.25,49.75 34.25,50.25 32.75,51.75 32.5,51.75 R8.1 | 5.25,43 3.5,44.75 J2.4 | J2.1 3.5,50.25 2,48.75 2,43 3,42 4.25,42 5.25,43 | J3.4 70.25,35 69.75,34.5 61,34.5 57.25,30.75 v57.25,30.5 | v32.25,48 32.25,47.75
  Bottom 0.127: J3.1 76.25,30.25 76.25,34 77.25,35 J3.4 | 35.25,32.25 35.25,35.25 33,37.5 J7.1 32.75,37.5 32.25,38 v32.25,48 | 35.25,32.25 35.25,31.75 34,30.5 34,29.75 33,29.75 J7.4 | 35.25,32.25 48,32.25 J8.4 48.25,32.25 48.25,32 55.75,32 v57.25,30.5
LCD_RX  (via drill 0.2)
  Top 0.127: v36,54.25 36,57.5 L1.RXI | v36,52.75 36,52.5 35.75,52.25 35.75,49 36.75,48 U4.32
  Bottom 0.127: v36,52.75 v36,54.25
LCD_TX
  Top 0.127: U4.31 37.25,48.75 37.5,49 38,49 38.5,49.5 38.5,54.25 L1.TX0
MISO  (via drill 0.2)
  Top 0.127: U4.39 34.75,43.75 31.75,40.75 v31.75,39.25 | v30.5,38 26.25,33.75 26.25,29.75 J4.1
  Route2 0.127: v30.5,38 v31.75,39.25
MOSI  (via drill 0.2)
  Top 0.127: U4.38 34.5,44.25 v31.75,41.5 | v29.25,39 29.25,37.75 22.75,31.25 22.75,25.25 23.5,24.5 J4.4
  Route2 0.127: v29.25,39 v31.75,41.5
N$1  (via drill 0.2)
  Top 0.127: v12.5,14.5 12.25,14.5 10.75,16 10.75,16.5 9.25,18 9.25,19 10.25,20 10.25,20.75 10,21 10,23.25 R4.4 | v12.5,12.5 12.5,9.25 11,7.75 D1.A1
  Bottom 0.127: v12.5,12.5 v12.5,14.5
N$2  (via drill 0.2)
  Top 0.127: R4.3 10.25,23.75 10.5,23.5 10.5,21 10.75,20.75 10.75,20 12.5,18.25 13.25,18.25 v13.75,17.75 | v13.75,13.75 13.75,9.5 11.25,7 10.5,7 10,6.5 D1.C2
  Bottom 0.127: v13.75,13.75 v13.75,17.75
N$3
  Top 0.127: R5.3 70.5,23.75 70,23.25 70,7.75 70.75,7 71.5,7 72,7.5 D5.A1
N$4
  Top 0.127: R5.8 73.25,24.75 74,24 74,13.25 72.25,11.5 71.5,11.5 71.25,11.75 71.25,12.25 D6.C2
N$5
  Top 0.127: R5.7 73.25,24.25 73.5,24 73.5,14 72,12.5 D6.C1
N$6
  Top 0.127: R4.7 11.5,24.25 14.25,21.5 14.25,15.5 11,12.25 D4.C1
N$7
  Top 0.127: R5.4 70.75,23.25 70.75,14.5 70.5,14.25 70.5,8.25 71,7.75 D5.A2
N$8  (via drill 0.2)
  Top 0.127: v61.75,32.75 61.75,30.25 64.25,27.75 68.75,27.75 71.5,25 71.5,23 71.25,22.75 71.25,13.75 D6.A2 | v49.5,45 47,45 46.25,45.75 U4.14
  Route2 0.127: v49.5,45 v61.75,32.75
N$9  (via drill 0.2)
  Top 0.127: v71.75,22.5 71.75,13.75 D6.A1 | v49.5,46.5 46.5,46.5 46.25,46.25 U4.15
  Route2 0.127: v71.75,22.5 71.75,25.25 67.5,29.5 67.5,31 66.75,31.75 64.25,31.75 v49.5,46.5
N$11
  Top 0.127: R4.5 11.25,23.25 11.25,23.75 R4.6 10.75,23.75 10.5,24 10.5,25.75 16,31.25 16,36 U2.1
N$12
  Top 0.127: U2.5 13,36 13,32.75 14.5,31.25 R7.1
N$13
  Top 0.127: R4.8 11.5,24.75 14.75,21.5 14.75,15.5 11.5,12.25 11.5,11.75 11.25,11.5 10.5,11.5 10.25,11.75 10.25,12.25 D4.C2
N$20
  Top 0.127: 42.5,49 42.25,48.75 U4.21 | 42.5,49 43.5,50 C11.1 | U4.22 41.75,48.75 42,49 42.5,49
N$21
  Top 0.127: U4.60 42.25,37.25 43.5,36 45.5,36 C13.1
PITCH  (via drill 0.2)
  Top 0.127: U4.2 46.25,39.75 47.75,38.25 v47.75,35.75
  Route15 0.127: J3.V 77,31 72.25,35.75 v47.75,35.75
  Bottom 0.127: v47.75,35.75 47.75,35.25 48,35 J8.V
PROG_SEL
  Top 0.127: U5.12 71.25,30.75 70.5,30.75 70,31.25 65.75,31.25 U5.4 65.5,31.25 64.25,31.25 63.25,30.25 63.25,29.25 64.25,28.25 68.75,28.25 69.25,27.75 70.75,27.75 78,20.5 78,11 S2.2
RESET  (via drill 0.2)
  Top 0.127: R2.1 26.5,52 29.5,52 C1.1 29.5,51.75 30,51.25 32.75,51.25 33.75,50.25 v33.75,50 | U4.12 39,44.75 v37.25,46.5 | B1.1 16,22 20.75,26.75 20.75,29.5 J4.5 20.75,29.75 27.5,36.5 v27.5,40.75
  Route2 0.127: v33.75,50 35.25,48.5 | 35.25,48.5 v37.25,46.5 | v27.5,40.75 35.25,48.5
RF  (via drill 0.2)
  Top 0.127: v12,14 11.75,13.75 11,13.75 D4.A1 | v44,45.25 44,46.25 44.5,46.75 U4.16
  Route15 0.127: v12,14 13.25,14 21,21.75 29.5,21.75 45.25,37.5 45.25,44 v44,45.25
RF_N
  Top 0.127: U4.9 55.25,43.25 56.5,44.5 56.15,44.85 B2.3
RF_P
  Top 0.127: U4.8 55.11,42.75 56.68,44.32 56.77,44.32 B2.4
ROLL  (via drill 0.2)
  Top 0.127: v47.25,28.5 47.25,35.25 | 47.25,35.25 47.25,37 45.5,38.75 45.5,39.25 U4.1 | v60.25,42.25 55,42.25 48,35.25 47.25,35.25
  Route2 0.127: J3.H 77,37 73.25,40.75 61.75,40.75 v60.25,42.25
  Bottom 0.127: v47.25,28.5 47.25,28 48,27.25 J8.H
RXI
  Top 0.127: U3.5 72.25,43.25 73,43.25 76.5,39.75 76.5,38.75 77.25,38 77.75,38 79,36.75 79,33.25 77.75,32 74.75,32 72.25,29.5 71.5,29.5 U5.10
RXI-0  (via drill 0.2)
  Top 0.127: v38.75,39.75 U4.47 | v67,30.75 70,30.75 70.75,30 71.25,30 U5.11
  Route2 0.127: v38.75,39.75 41,39.75 42,40.75 53,40.75 63,30.75 v67,30.75
RXI-1  (via drill 0.2)
  Top 0.127: v69,30.25 70.5,28.75 71.25,28.75 U5.9 | v35.5,54.75 34.25,54.75 33.75,55.25 19.75,55.25 11.75,47.25 JP1.CTS
  Route2 0.127: v69,30.25 67.5,31.75 67.5,32.5 45.25,54.75 v35.5,54.75
RXLED  (via drill 0.2)
  Top 0.127: v65,27.25 65.5,26.75 65.5,11.75 70.75,6.5 71,6.5 D5.C2 | v65,39.75 66.5,41.25 66.5,43.75 65.5,44.75 65,44.75 U3.22
  Bottom 0.127: v65,39.75 v65,27.25
SCK  (via drill 0.2)
  Top 0.127: U4.37 34.25,44.75 31.25,41.75 v31.25,39.75 | v30,38.5 30,38 23.5,31.5 J4.3
  Route2 0.127: v30,38.5 v31.25,39.75
THROTTLE  (via drill 0.2)
  Top 0.127: v44.75,37.75 44.5,38 44.25,38 U4.64 | v27.75,44.25 9.5,44.25 5,48.75 3.5,48.75 J2.V
  Route15 0.127: v33.25,26.25 39.5,32.5 | 39.5,32.5 v44.75,37.75 | 39.5,32.5 v27.75,44.25
  Bottom 0.127: v33.25,26.25 33.25,26.75 33.12,26.88 arc-10 32.9,27.14 J7.V
TXLED  (via drill 0.2)
  Top 0.127: v61.25,34 61.25,30.25 65,26.5 65,11.25 70.75,5.5 71.5,5.5 71.75,5.75 71.75,6.25 D5.C1 | v61.25,36.75 61.25,39 63.25,41 63.25,43 64.25,44 64.75,44 U3.23
  Bottom 0.127: v61.25,36.75 v61.25,34
TXO
  Top 0.127: U3.1 72,40.75 70.25,40.75 70,41 70,48.25 71.5,49.75 73,49.75 76.5,46.25 76.5,40.75 77.25,40 77.75,40 79.5,38.25 79.5,31.75 77.75,30 74,30 72.25,28.25 69.25,28.25 67.5,30 65.75,30 U5.6
TXO-0  (via drill 0.2)
  Top 0.127: v44,40.25 U4.46 | v63.75,29.5 65.5,29.5 U5.7
  Route2 0.127: v44,40.25 44.25,40 53.25,40 v63.75,29.5
TXO-1  (via drill 0.2)
  Top 0.127: v64,30.25 64.25,30.5 65.5,30.5 U5.5 | v20.25,48.75 20,49 16,49 14.25,47.25 JP1.VCC
  Route15 0.127: v64,30.25 62,32.25 50.5,32.25 47,35.75 47,43 44,46 40.5,46 38,48.5 20.5,48.5 v20.25,48.75
USB_D_N
  Top 0.152: J1.2 70.15,52.52 69.97,52.34 69.97,50.28 68.54,48.85 66.48,48.85 66.21,48.58 U3.16
USB_D_P
  Top 0.152: J1.3 69.5,52.52 69.69,52.34 69.69,51 69.27,50.59 69.27,49.98 68.42,49.13 66.48,49.13 66.39,49.23 U3.15
VBAT  (via drill 0.38)
  Top 0.254: v5.7,12.24 S1.2 5.75,11 5.75,9.25 11.5,3.5 25,3.5 32.25,10.75 32.25,29 32.75,29.5 | D2.C v14.23,41 v14.77,41 D3.C 17.75,41 18.5,41.75 27.5,41.75 31,38.25 31,33.25 30.25,32.5 30.25,32 32.75,29.5 | 32.75,29.5 35.75,26.5 45.5,26.5 48.25,23.75 59.25,23.75 P2.T
VBUS  (via drill 0.38)
  Top 0.254: D2.A v8.77,41 | J1.1 v70.8,52.38 70.75,52.25 70.75,49.5 67,45.75 67,41 56.5,30.5 | D1.A2 v9.21,7.73 9,7.75 9,13.25 7.25,15 | U2.4 v14.24,37.95 | 7.25,15 6.75,15.5 6.75,31.5 10.5,35.25 v10.5,35.3 C5.1 9.75,37 9.8,37.01 | 56.5,30.5 51,25 P1.T | 7.25,15 4.5,12.25 4.5,9.75 12,2.25 52.75,2.25 55,4.5 56,4.5 61,9.5 61,24 61.75,24.75 61.75,25.25 56.5,30.5
  pour Top: 13.5,37 8.5,37 8.5,42 13.5,42
VREG_IN  (via drill 0.38)
  Top 0.254: v2.06,13.5 S1.1 3.5,13.5 4.5,14.5 4.5,38.5 8.5,42.5 27.5,42.5 | U3.20 v63.7,45.98 63.5,45.75 63,45.25 C7.1 v61.5,44.3 v61.5,44.05 C8.1 61.5,42.75 47.75,29 47.75,28.25 46.5,27 36,27 31.5,31.5 31.5,38.5 27.5,42.5 | 27.5,42.5 34.75,49.75 34.75,52.25 37.75,55.25 40,55.25 42.25,57.5 45.75,57.5 L1.RAW
YAW  (via drill 0.2)
  Top 0.127: U4.63 43.75,37.25 44.25,36.75 46.25,36.75 46.5,36.5 46.5,28.25 45.75,27.5 44.5,27.5 42.25,29.75 42.25,30 41.25,31 39.75,31 37.5,28.75 37.5,28.5 37.25,28.25 35.25,28.25 32.75,30.75 v32.75,33.75 | J2.H 3.5,43.5 2.5,44.5 2.5,45.25 3.25,46 7.25,46 9.75,43.5 v27.25,43.5
  Bottom 0.127: v32.75,33.75 32.75,34.75 J7.H 32.75,35 32,35 28.75,38.25 28.75,42 v27.25,43.5
(copper drawn outside any net)
  shapes: Top area x1

### Text on the board
Top: cutout for battery velcro'd to bottom of PCM | add oscilator to LCD tdocu and then consider moving connectors in to avoid it. | 0603? | shrink it horizontally a bit and it'll fit very nicely into by plastic box.
tPlace: GRN | BLK | Ignore four drills outside of board area | Ignore four drills outside of board area | Steven / Swanson | VBUS | GND | 3V3 | VBAT | ON | QUAD | PWR | RX/TX | STATUS | BTN1 | FTDI RX | FTDI TX | CHARGE | DONE | OFF | RST | RC | BTN2 | Mark IV | Rev 7 | CSE176e Remote
Document: Mounting w/o LCD: / 1.6mm controller board / 9mm standoff (3x donuts) / 3mm baseplate / 1.6mm runout / 15.2mm total / ~5/8in total | Mounting w/ LCD: / 1.6mm LCD / 12mm standoff (4x) / 1.6mm controller board / 9mm standoff (3x donuts) / 3mm baseplate / 1.6mm nut / 28.8 mm total / ~1 1/4 in | Mounting gimbals: / 1in standoffs.
baseplateart: CSE176e | <--THROTTLE--> | <--PITCH--> | <--YAW--> | To achieve great things, two things are needed: a plan and not quite enough time. / --Leonard Bernstein | <--ROLL-->